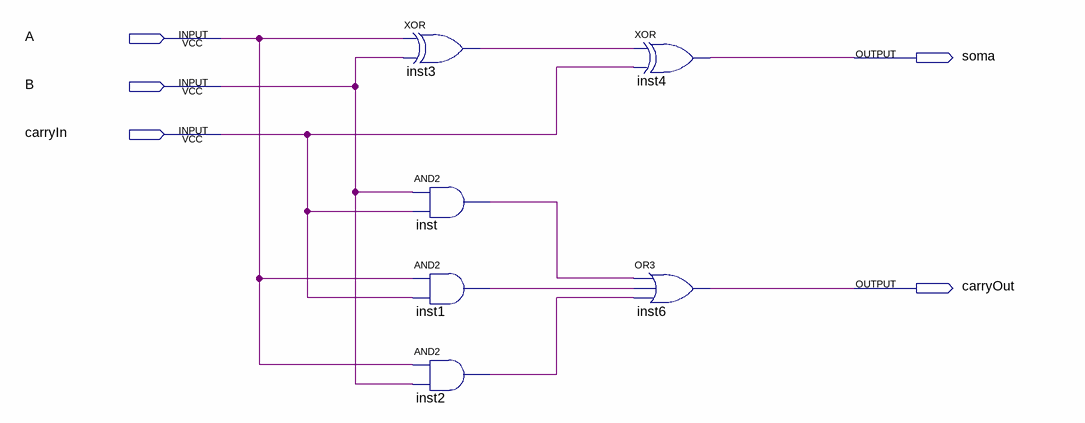
[diagram p0: schematic sheet]
// Quartus schematic somador_completo.bdf as structural Verilog: 6 symbols, 5 pins
module somador_completo (
  input  A,
  input  B,
  input  carryIn,
  output soma,
  output carryOut
);

  wire inst1_out, inst2_out, inst3_out, inst_out;

  xor inst3 (inst3_out, A, B);
  and inst (inst_out, B, carryIn);
  and inst1 (inst1_out, A, carryIn);
  and inst2 (inst2_out, A, B);
  xor inst4 (soma, inst3_out, carryIn);
  or inst6 (carryOut, inst_out, inst1_out, inst2_out);
endmodule
